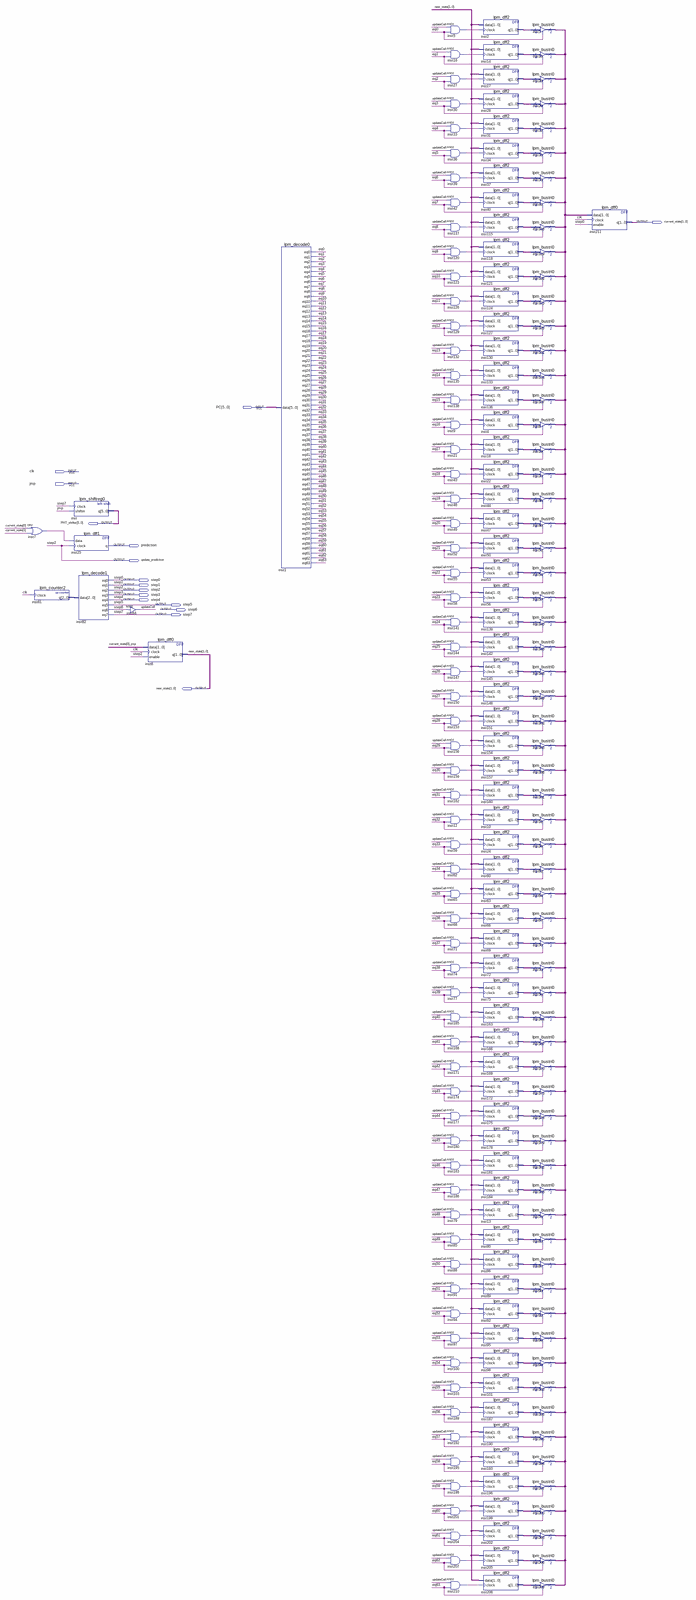
[diagram p0: schematic sheet, whole]
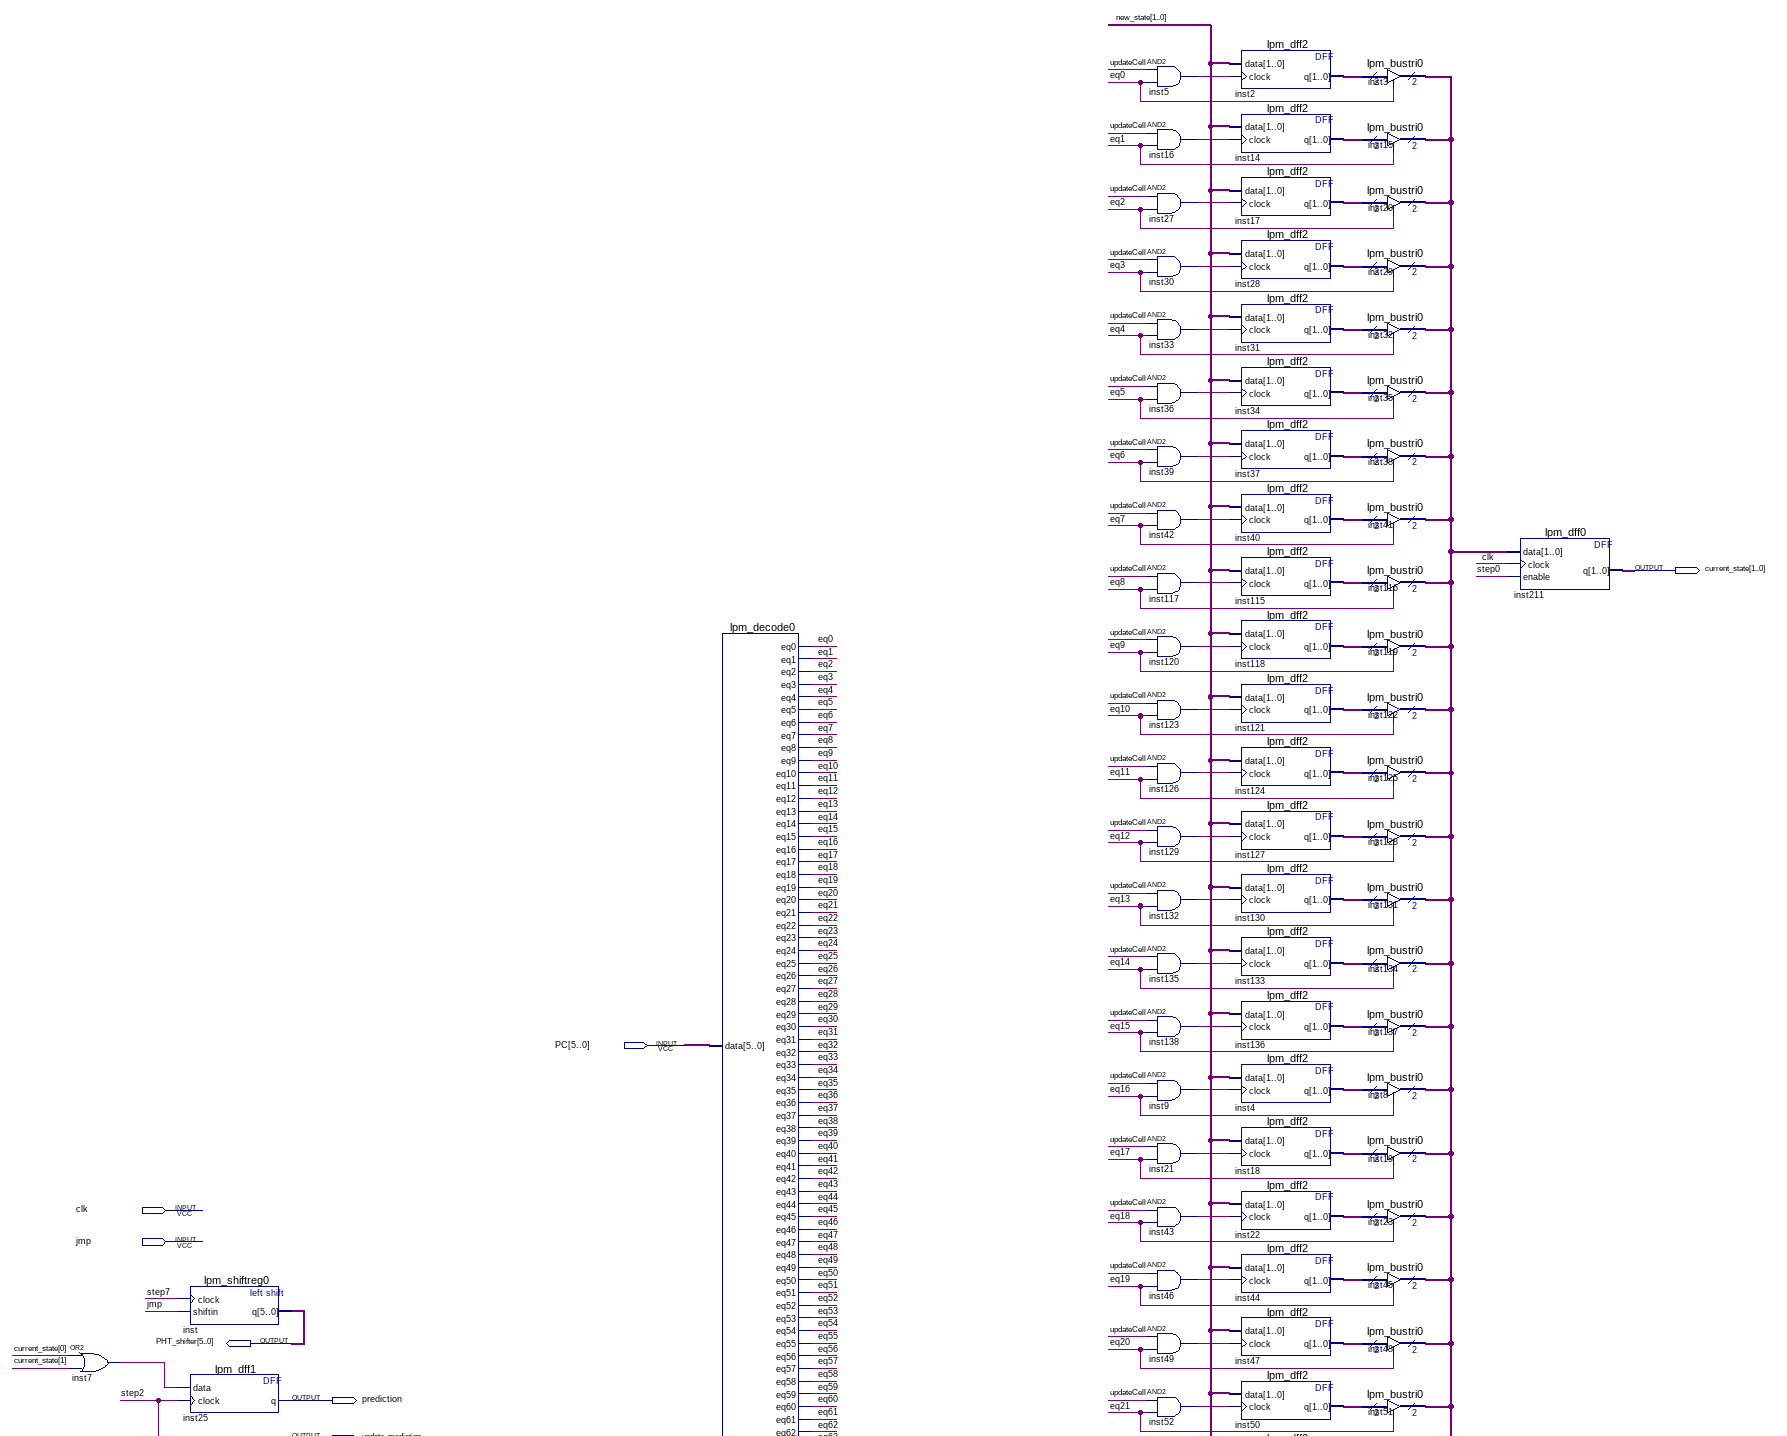
[diagram p1: schematic sheet, upper part]
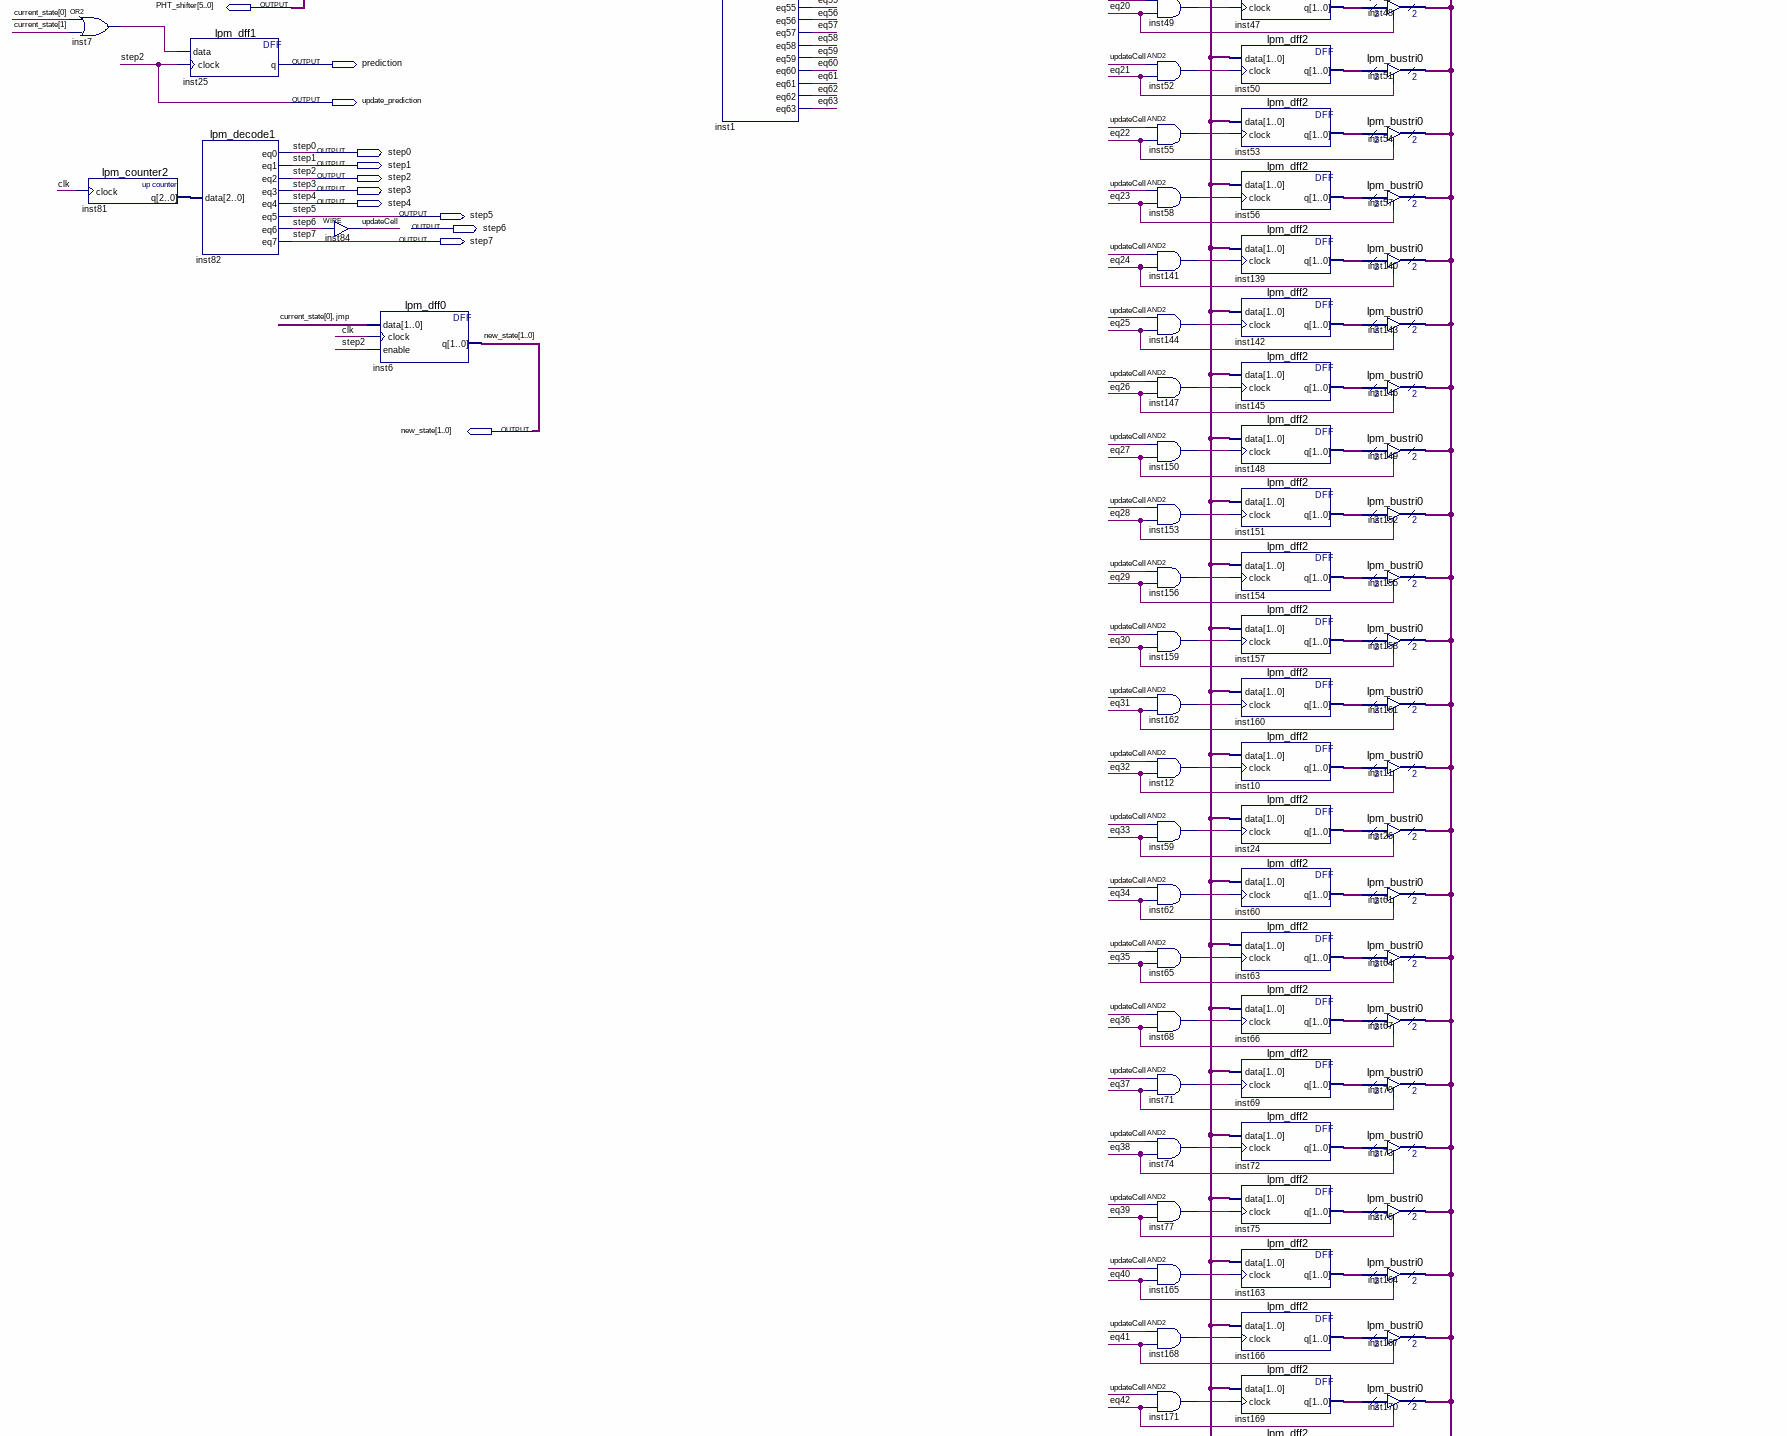
[diagram p2: schematic sheet, middle part]
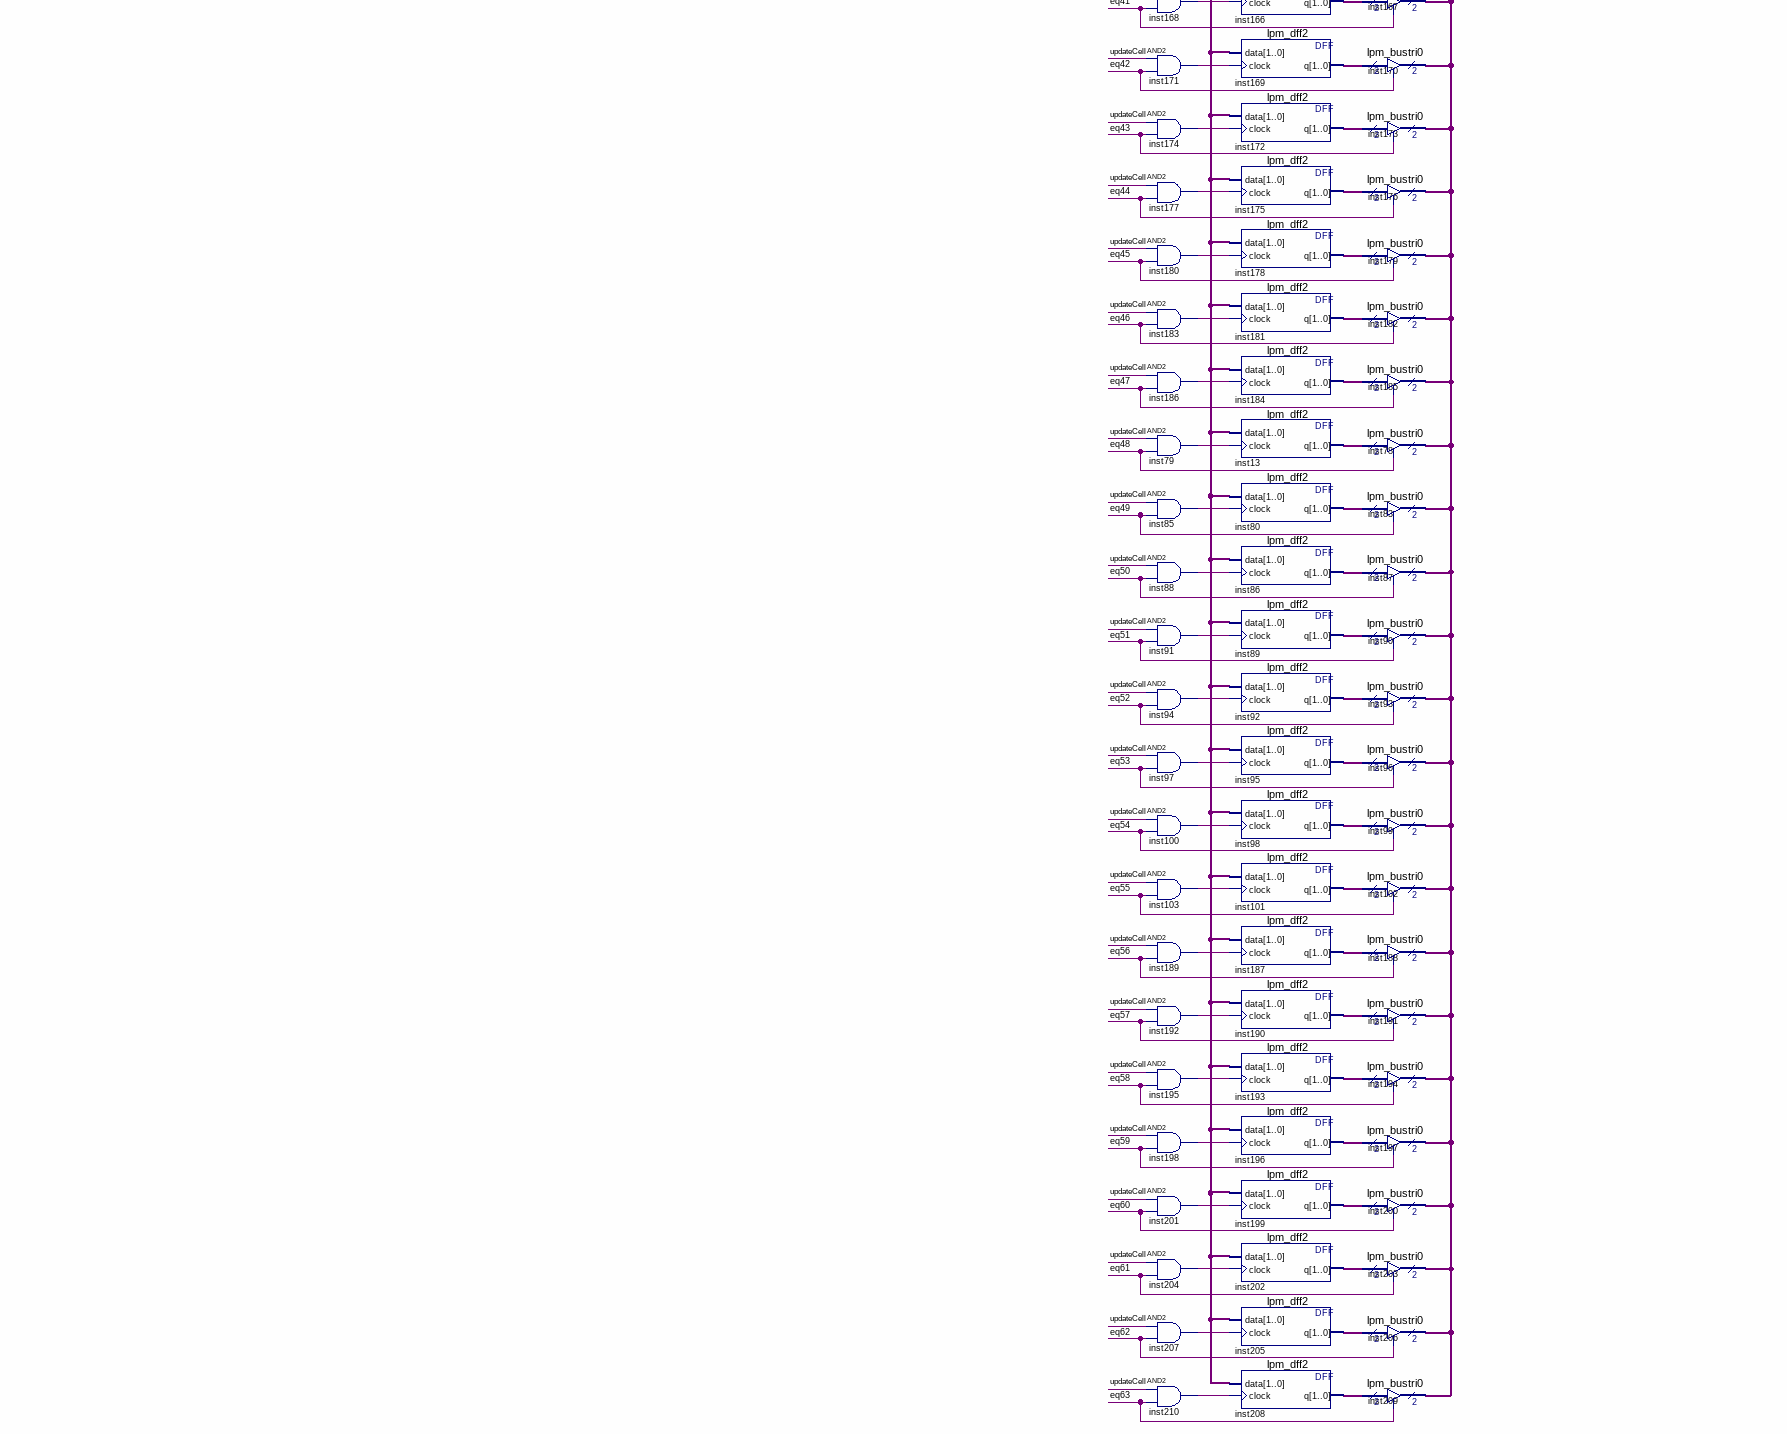
[diagram p3: schematic sheet, lower part]
// Quartus schematic Prediction.bdf as structural Verilog: 201 symbols, 16 pins
module Prediction (
  input  [5:0] PC,
  input  clk,
  input  jmp,
  output [1:0] current_state,
  output [5:0] PHT_shifter,
  output prediction,
  output update_prediction,
  output step0,
  output step1,
  output step2,
  output step3,
  output step4,
  output step5,
  output step6,
  output step7,
  output [1:0] new_state
);

  wire eq0, eq1, eq2, eq3, eq4, eq5, eq6, eq7, eq8, eq9, eq10, eq11, eq12, eq13, eq14, eq15, eq16, eq17,
       eq18, eq19, eq20, eq21, eq22, eq23, eq24, eq25, eq26, eq27, eq28, eq29, eq30, eq31, eq32, eq33, eq34,
       eq35, eq36, eq37, eq38, eq39, eq40, eq41, eq42, eq43, eq44, eq45, eq46, eq47, eq48, eq49, eq50, eq51,
       eq52, eq53, eq54, eq55, eq56, eq57, eq58, eq59, eq60, eq61, eq62, eq63, inst5_out, inst7_out,
       inst9_out, inst12_out, inst16_out, inst21_out, inst27_out, inst30_out, inst33_out, inst36_out,
       inst39_out, inst42_out, inst43_out, inst46_out, inst49_out, inst52_out, inst55_out, inst58_out,
       inst59_out, inst62_out, inst65_out, inst68_out, inst71_out, inst74_out, inst77_out, inst79_out,
       inst85_out, inst88_out, inst91_out, inst94_out, inst97_out, inst100_out, inst103_out, inst117_out,
       inst120_out, inst123_out, inst126_out, inst129_out, inst132_out, inst135_out, inst138_out,
       inst141_out, inst144_out, inst147_out, inst150_out, inst153_out, inst156_out, inst159_out,
       inst162_out, inst165_out, inst168_out, inst171_out, inst174_out, inst177_out, inst180_out,
       inst183_out, inst186_out, inst189_out, inst192_out, inst195_out, inst198_out, inst201_out,
       inst204_out, inst207_out, inst210_out, updateCell;
  wire [1:0] inst2_q, inst3_tridata, inst4_q, inst10_q, inst13_q, inst14_q, inst17_q, inst18_q, inst22_q,
       inst24_q, inst28_q, inst31_q, inst34_q, inst37_q, inst40_q, inst44_q, inst47_q, inst50_q, inst53_q,
       inst56_q, inst60_q, inst63_q, inst66_q, inst69_q, inst72_q, inst75_q, inst80_q, inst86_q, inst89_q,
       inst92_q, inst95_q, inst98_q, inst101_q, inst115_q, inst118_q, inst121_q, inst124_q, inst127_q,
       inst130_q, inst133_q, inst136_q, inst139_q, inst142_q, inst145_q, inst148_q, inst151_q, inst154_q,
       inst157_q, inst160_q, inst163_q, inst166_q, inst169_q, inst172_q, inst175_q, inst178_q, inst181_q,
       inst184_q, inst187_q, inst190_q, inst193_q, inst196_q, inst199_q, inst202_q, inst205_q, inst208_q;
  wire [2:0] inst81_q;

  or inst7 (inst7_out, current_state[0], current_state[1]);
  lpm_counter2 inst81 (.clock(clk), .q(inst81_q));
  lpm_shiftreg0 inst (.clock(step7), .shiftin(jmp), .q(PHT_shifter));
  lpm_dff1 inst25 (.data(inst7_out), .clock(step2), .q(prediction));
  lpm_decode1 inst82 (
    .data(inst81_q), .eq0(step0), .eq1(step1), .eq2(step2), .eq3(step3), .eq4(step4), .eq5(step5),
    .eq6(step6), .eq7(step7));
  assign updateCell = step6;  // WIRE inst84
  lpm_dff0 inst6 (.data({current_state[0], jmp}), .clock(clk), .enable(step2), .q(new_state));
  lpm_decode0 inst1 (
    .data(PC), .eq0(eq0), .eq1(eq1), .eq2(eq2), .eq3(eq3), .eq4(eq4), .eq5(eq5), .eq6(eq6), .eq7(eq7),
    .eq8(eq8), .eq9(eq9), .eq10(eq10), .eq11(eq11), .eq12(eq12), .eq13(eq13), .eq14(eq14), .eq15(eq15),
    .eq16(eq16), .eq17(eq17), .eq18(eq18), .eq19(eq19), .eq20(eq20), .eq21(eq21), .eq22(eq22), .eq23(eq23),
    .eq24(eq24), .eq25(eq25), .eq26(eq26), .eq27(eq27), .eq28(eq28), .eq29(eq29), .eq30(eq30), .eq31(eq31),
    .eq32(eq32), .eq33(eq33), .eq34(eq34), .eq35(eq35), .eq36(eq36), .eq37(eq37), .eq38(eq38), .eq39(eq39),
    .eq40(eq40), .eq41(eq41), .eq42(eq42), .eq43(eq43), .eq44(eq44), .eq45(eq45), .eq46(eq46), .eq47(eq47),
    .eq48(eq48), .eq49(eq49), .eq50(eq50), .eq51(eq51), .eq52(eq52), .eq53(eq53), .eq54(eq54), .eq55(eq55),
    .eq56(eq56), .eq57(eq57), .eq58(eq58), .eq59(eq59), .eq60(eq60), .eq61(eq61), .eq62(eq62), .eq63(eq63));
  and inst5 (inst5_out, updateCell, eq0);
  and inst16 (inst16_out, updateCell, eq1);
  and inst27 (inst27_out, updateCell, eq2);
  and inst30 (inst30_out, updateCell, eq3);
  and inst33 (inst33_out, updateCell, eq4);
  and inst36 (inst36_out, updateCell, eq5);
  and inst39 (inst39_out, updateCell, eq6);
  and inst42 (inst42_out, updateCell, eq7);
  and inst117 (inst117_out, updateCell, eq8);
  and inst120 (inst120_out, updateCell, eq9);
  and inst123 (inst123_out, updateCell, eq10);
  and inst126 (inst126_out, updateCell, eq11);
  and inst129 (inst129_out, updateCell, eq12);
  and inst132 (inst132_out, updateCell, eq13);
  and inst135 (inst135_out, updateCell, eq14);
  and inst138 (inst138_out, updateCell, eq15);
  and inst9 (inst9_out, updateCell, eq16);
  and inst21 (inst21_out, updateCell, eq17);
  and inst43 (inst43_out, updateCell, eq18);
  and inst46 (inst46_out, updateCell, eq19);
  and inst49 (inst49_out, updateCell, eq20);
  and inst52 (inst52_out, updateCell, eq21);
  and inst55 (inst55_out, updateCell, eq22);
  and inst58 (inst58_out, updateCell, eq23);
  and inst141 (inst141_out, updateCell, eq24);
  and inst144 (inst144_out, updateCell, eq25);
  and inst147 (inst147_out, updateCell, eq26);
  and inst150 (inst150_out, updateCell, eq27);
  and inst153 (inst153_out, updateCell, eq28);
  and inst156 (inst156_out, updateCell, eq29);
  and inst159 (inst159_out, updateCell, eq30);
  and inst162 (inst162_out, updateCell, eq31);
  and inst12 (inst12_out, updateCell, eq32);
  and inst59 (inst59_out, updateCell, eq33);
  and inst62 (inst62_out, updateCell, eq34);
  and inst65 (inst65_out, updateCell, eq35);
  and inst68 (inst68_out, updateCell, eq36);
  and inst71 (inst71_out, updateCell, eq37);
  and inst74 (inst74_out, updateCell, eq38);
  and inst77 (inst77_out, updateCell, eq39);
  and inst165 (inst165_out, updateCell, eq40);
  and inst168 (inst168_out, updateCell, eq41);
  and inst171 (inst171_out, updateCell, eq42);
  and inst174 (inst174_out, updateCell, eq43);
  and inst177 (inst177_out, updateCell, eq44);
  and inst180 (inst180_out, updateCell, eq45);
  and inst183 (inst183_out, updateCell, eq46);
  and inst186 (inst186_out, updateCell, eq47);
  and inst79 (inst79_out, updateCell, eq48);
  and inst85 (inst85_out, updateCell, eq49);
  and inst88 (inst88_out, updateCell, eq50);
  and inst91 (inst91_out, updateCell, eq51);
  and inst94 (inst94_out, updateCell, eq52);
  and inst97 (inst97_out, updateCell, eq53);
  and inst100 (inst100_out, updateCell, eq54);
  and inst103 (inst103_out, updateCell, eq55);
  and inst189 (inst189_out, updateCell, eq56);
  and inst192 (inst192_out, updateCell, eq57);
  and inst195 (inst195_out, updateCell, eq58);
  and inst198 (inst198_out, updateCell, eq59);
  and inst201 (inst201_out, updateCell, eq60);
  and inst204 (inst204_out, updateCell, eq61);
  and inst207 (inst207_out, updateCell, eq62);
  and inst210 (inst210_out, updateCell, eq63);
  lpm_dff2 inst2 (.data(new_state), .clock(inst5_out), .q(inst2_q));
  lpm_dff2 inst14 (.data(new_state), .clock(inst16_out), .q(inst14_q));
  lpm_dff2 inst17 (.data(new_state), .clock(inst27_out), .q(inst17_q));
  lpm_dff2 inst28 (.data(new_state), .clock(inst30_out), .q(inst28_q));
  lpm_dff2 inst31 (.data(new_state), .clock(inst33_out), .q(inst31_q));
  lpm_dff2 inst34 (.data(new_state), .clock(inst36_out), .q(inst34_q));
  lpm_dff2 inst37 (.data(new_state), .clock(inst39_out), .q(inst37_q));
  lpm_dff2 inst40 (.data(new_state), .clock(inst42_out), .q(inst40_q));
  lpm_dff2 inst115 (.data(new_state), .clock(inst117_out), .q(inst115_q));
  lpm_dff2 inst118 (.data(new_state), .clock(inst120_out), .q(inst118_q));
  lpm_dff2 inst121 (.data(new_state), .clock(inst123_out), .q(inst121_q));
  lpm_dff2 inst124 (.data(new_state), .clock(inst126_out), .q(inst124_q));
  lpm_dff2 inst127 (.data(new_state), .clock(inst129_out), .q(inst127_q));
  lpm_dff2 inst130 (.data(new_state), .clock(inst132_out), .q(inst130_q));
  lpm_dff2 inst133 (.data(new_state), .clock(inst135_out), .q(inst133_q));
  lpm_dff2 inst136 (.data(new_state), .clock(inst138_out), .q(inst136_q));
  lpm_dff2 inst4 (.data(new_state), .clock(inst9_out), .q(inst4_q));
  lpm_dff2 inst18 (.data(new_state), .clock(inst21_out), .q(inst18_q));
  lpm_dff2 inst22 (.data(new_state), .clock(inst43_out), .q(inst22_q));
  lpm_dff2 inst44 (.data(new_state), .clock(inst46_out), .q(inst44_q));
  lpm_dff2 inst47 (.data(new_state), .clock(inst49_out), .q(inst47_q));
  lpm_dff2 inst50 (.data(new_state), .clock(inst52_out), .q(inst50_q));
  lpm_dff2 inst53 (.data(new_state), .clock(inst55_out), .q(inst53_q));
  lpm_dff2 inst56 (.data(new_state), .clock(inst58_out), .q(inst56_q));
  lpm_dff2 inst139 (.data(new_state), .clock(inst141_out), .q(inst139_q));
  lpm_dff2 inst142 (.data(new_state), .clock(inst144_out), .q(inst142_q));
  lpm_dff2 inst145 (.data(new_state), .clock(inst147_out), .q(inst145_q));
  lpm_dff2 inst148 (.data(new_state), .clock(inst150_out), .q(inst148_q));
  lpm_dff2 inst151 (.data(new_state), .clock(inst153_out), .q(inst151_q));
  lpm_dff2 inst154 (.data(new_state), .clock(inst156_out), .q(inst154_q));
  lpm_dff2 inst157 (.data(new_state), .clock(inst159_out), .q(inst157_q));
  lpm_dff2 inst160 (.data(new_state), .clock(inst162_out), .q(inst160_q));
  lpm_dff2 inst10 (.data(new_state), .clock(inst12_out), .q(inst10_q));
  lpm_dff2 inst24 (.data(new_state), .clock(inst59_out), .q(inst24_q));
  lpm_dff2 inst60 (.data(new_state), .clock(inst62_out), .q(inst60_q));
  lpm_dff2 inst63 (.data(new_state), .clock(inst65_out), .q(inst63_q));
  lpm_dff2 inst66 (.data(new_state), .clock(inst68_out), .q(inst66_q));
  lpm_dff2 inst69 (.data(new_state), .clock(inst71_out), .q(inst69_q));
  lpm_dff2 inst72 (.data(new_state), .clock(inst74_out), .q(inst72_q));
  lpm_dff2 inst75 (.data(new_state), .clock(inst77_out), .q(inst75_q));
  lpm_dff2 inst163 (.data(new_state), .clock(inst165_out), .q(inst163_q));
  lpm_dff2 inst166 (.data(new_state), .clock(inst168_out), .q(inst166_q));
  lpm_dff2 inst169 (.data(new_state), .clock(inst171_out), .q(inst169_q));
  lpm_dff2 inst172 (.data(new_state), .clock(inst174_out), .q(inst172_q));
  lpm_dff2 inst175 (.data(new_state), .clock(inst177_out), .q(inst175_q));
  lpm_dff2 inst178 (.data(new_state), .clock(inst180_out), .q(inst178_q));
  lpm_dff2 inst181 (.data(new_state), .clock(inst183_out), .q(inst181_q));
  lpm_dff2 inst184 (.data(new_state), .clock(inst186_out), .q(inst184_q));
  lpm_dff2 inst13 (.data(new_state), .clock(inst79_out), .q(inst13_q));
  lpm_dff2 inst80 (.data(new_state), .clock(inst85_out), .q(inst80_q));
  lpm_dff2 inst86 (.data(new_state), .clock(inst88_out), .q(inst86_q));
  lpm_dff2 inst89 (.data(new_state), .clock(inst91_out), .q(inst89_q));
  lpm_dff2 inst92 (.data(new_state), .clock(inst94_out), .q(inst92_q));
  lpm_dff2 inst95 (.data(new_state), .clock(inst97_out), .q(inst95_q));
  lpm_dff2 inst98 (.data(new_state), .clock(inst100_out), .q(inst98_q));
  lpm_dff2 inst101 (.data(new_state), .clock(inst103_out), .q(inst101_q));
  lpm_dff2 inst187 (.data(new_state), .clock(inst189_out), .q(inst187_q));
  lpm_dff2 inst190 (.data(new_state), .clock(inst192_out), .q(inst190_q));
  lpm_dff2 inst193 (.data(new_state), .clock(inst195_out), .q(inst193_q));
  lpm_dff2 inst196 (.data(new_state), .clock(inst198_out), .q(inst196_q));
  lpm_dff2 inst199 (.data(new_state), .clock(inst201_out), .q(inst199_q));
  lpm_dff2 inst202 (.data(new_state), .clock(inst204_out), .q(inst202_q));
  lpm_dff2 inst205 (.data(new_state), .clock(inst207_out), .q(inst205_q));
  lpm_dff2 inst208 (.data(new_state), .clock(inst210_out), .q(inst208_q));
  lpm_bustri0 inst3 (.enabledt(eq0), .data(inst2_q), .tridata(inst3_tridata));
  lpm_bustri0 inst15 (.enabledt(eq1), .data(inst14_q), .tridata(inst3_tridata));
  lpm_bustri0 inst20 (.enabledt(eq2), .data(inst17_q), .tridata(inst3_tridata));
  lpm_bustri0 inst29 (.enabledt(eq3), .data(inst28_q), .tridata(inst3_tridata));
  lpm_bustri0 inst32 (.enabledt(eq4), .data(inst31_q), .tridata(inst3_tridata));
  lpm_bustri0 inst35 (.enabledt(eq5), .data(inst34_q), .tridata(inst3_tridata));
  lpm_bustri0 inst38 (.enabledt(eq6), .data(inst37_q), .tridata(inst3_tridata));
  lpm_bustri0 inst41 (.enabledt(eq7), .data(inst40_q), .tridata(inst3_tridata));
  lpm_bustri0 inst116 (.enabledt(eq8), .data(inst115_q), .tridata(inst3_tridata));
  lpm_bustri0 inst119 (.enabledt(eq9), .data(inst118_q), .tridata(inst3_tridata));
  lpm_bustri0 inst122 (.enabledt(eq10), .data(inst121_q), .tridata(inst3_tridata));
  lpm_bustri0 inst125 (.enabledt(eq11), .data(inst124_q), .tridata(inst3_tridata));
  lpm_bustri0 inst128 (.enabledt(eq12), .data(inst127_q), .tridata(inst3_tridata));
  lpm_bustri0 inst131 (.enabledt(eq13), .data(inst130_q), .tridata(inst3_tridata));
  lpm_bustri0 inst134 (.enabledt(eq14), .data(inst133_q), .tridata(inst3_tridata));
  lpm_bustri0 inst137 (.enabledt(eq15), .data(inst136_q), .tridata(inst3_tridata));
  lpm_bustri0 inst8 (.enabledt(eq16), .data(inst4_q), .tridata(inst3_tridata));
  lpm_bustri0 inst19 (.enabledt(eq17), .data(inst18_q), .tridata(inst3_tridata));
  lpm_bustri0 inst23 (.enabledt(eq18), .data(inst22_q), .tridata(inst3_tridata));
  lpm_bustri0 inst45 (.enabledt(eq19), .data(inst44_q), .tridata(inst3_tridata));
  lpm_bustri0 inst48 (.enabledt(eq20), .data(inst47_q), .tridata(inst3_tridata));
  lpm_bustri0 inst51 (.enabledt(eq21), .data(inst50_q), .tridata(inst3_tridata));
  lpm_bustri0 inst54 (.enabledt(eq22), .data(inst53_q), .tridata(inst3_tridata));
  lpm_bustri0 inst57 (.enabledt(eq23), .data(inst56_q), .tridata(inst3_tridata));
  lpm_bustri0 inst140 (.enabledt(eq24), .data(inst139_q), .tridata(inst3_tridata));
  lpm_bustri0 inst143 (.enabledt(eq25), .data(inst142_q), .tridata(inst3_tridata));
  lpm_bustri0 inst146 (.enabledt(eq26), .data(inst145_q), .tridata(inst3_tridata));
  lpm_bustri0 inst149 (.enabledt(eq27), .data(inst148_q), .tridata(inst3_tridata));
  lpm_bustri0 inst152 (.enabledt(eq28), .data(inst151_q), .tridata(inst3_tridata));
  lpm_bustri0 inst155 (.enabledt(eq29), .data(inst154_q), .tridata(inst3_tridata));
  lpm_bustri0 inst158 (.enabledt(eq30), .data(inst157_q), .tridata(inst3_tridata));
  lpm_bustri0 inst161 (.enabledt(eq31), .data(inst160_q), .tridata(inst3_tridata));
  lpm_bustri0 inst11 (.enabledt(eq32), .data(inst10_q), .tridata(inst3_tridata));
  lpm_bustri0 inst26 (.enabledt(eq33), .data(inst24_q), .tridata(inst3_tridata));
  lpm_bustri0 inst61 (.enabledt(eq34), .data(inst60_q), .tridata(inst3_tridata));
  lpm_bustri0 inst64 (.enabledt(eq35), .data(inst63_q), .tridata(inst3_tridata));
  lpm_bustri0 inst67 (.enabledt(eq36), .data(inst66_q), .tridata(inst3_tridata));
  lpm_bustri0 inst70 (.enabledt(eq37), .data(inst69_q), .tridata(inst3_tridata));
  lpm_bustri0 inst73 (.enabledt(eq38), .data(inst72_q), .tridata(inst3_tridata));
  lpm_bustri0 inst76 (.enabledt(eq39), .data(inst75_q), .tridata(inst3_tridata));
  lpm_bustri0 inst164 (.enabledt(eq40), .data(inst163_q), .tridata(inst3_tridata));
  lpm_bustri0 inst167 (.enabledt(eq41), .data(inst166_q), .tridata(inst3_tridata));
  lpm_bustri0 inst170 (.enabledt(eq42), .data(inst169_q), .tridata(inst3_tridata));
  lpm_bustri0 inst173 (.enabledt(eq43), .data(inst172_q), .tridata(inst3_tridata));
  lpm_bustri0 inst176 (.enabledt(eq44), .data(inst175_q), .tridata(inst3_tridata));
  lpm_bustri0 inst179 (.enabledt(eq45), .data(inst178_q), .tridata(inst3_tridata));
  lpm_bustri0 inst182 (.enabledt(eq46), .data(inst181_q), .tridata(inst3_tridata));
  lpm_bustri0 inst185 (.enabledt(eq47), .data(inst184_q), .tridata(inst3_tridata));
  lpm_bustri0 inst78 (.enabledt(eq48), .data(inst13_q), .tridata(inst3_tridata));
  lpm_bustri0 inst83 (.enabledt(eq49), .data(inst80_q), .tridata(inst3_tridata));
  lpm_bustri0 inst87 (.enabledt(eq50), .data(inst86_q), .tridata(inst3_tridata));
  lpm_bustri0 inst90 (.enabledt(eq51), .data(inst89_q), .tridata(inst3_tridata));
  lpm_bustri0 inst93 (.enabledt(eq52), .data(inst92_q), .tridata(inst3_tridata));
  lpm_bustri0 inst96 (.enabledt(eq53), .data(inst95_q), .tridata(inst3_tridata));
  lpm_bustri0 inst99 (.enabledt(eq54), .data(inst98_q), .tridata(inst3_tridata));
  lpm_bustri0 inst102 (.enabledt(eq55), .data(inst101_q), .tridata(inst3_tridata));
  lpm_bustri0 inst188 (.enabledt(eq56), .data(inst187_q), .tridata(inst3_tridata));
  lpm_bustri0 inst191 (.enabledt(eq57), .data(inst190_q), .tridata(inst3_tridata));
  lpm_bustri0 inst194 (.enabledt(eq58), .data(inst193_q), .tridata(inst3_tridata));
  lpm_bustri0 inst197 (.enabledt(eq59), .data(inst196_q), .tridata(inst3_tridata));
  lpm_bustri0 inst200 (.enabledt(eq60), .data(inst199_q), .tridata(inst3_tridata));
  lpm_bustri0 inst203 (.enabledt(eq61), .data(inst202_q), .tridata(inst3_tridata));
  lpm_bustri0 inst206 (.enabledt(eq62), .data(inst205_q), .tridata(inst3_tridata));
  lpm_bustri0 inst209 (.enabledt(eq63), .data(inst208_q), .tridata(inst3_tridata));
  lpm_dff0 inst211 (.data(inst3_tridata), .clock(clk), .enable(step0), .q(current_state));

  assign update_prediction = step2;
endmodule
